# EasyEDA Pro project Omnimo_nRF52840_1v2.eprj, schematic Omnimo nRF52840_v1_2

## Sheets
1 Omnimo_nrf52840_v1_2_sheet_1: Board Name: Omnimo nRF52840_v1_2; Create Date: 2025-02-22; Page Name: Omnimo_nrf52840_v1_2_sheet_1; Project Name: Omnimo_nRF52840_1v2; Schematic Name: Omnimo nRF52840_v1_2; Update Date: 2025-11-02; Company: eAFAQ; Drawn: I. MEZZAH; Page Size: A4; Version: V1.2
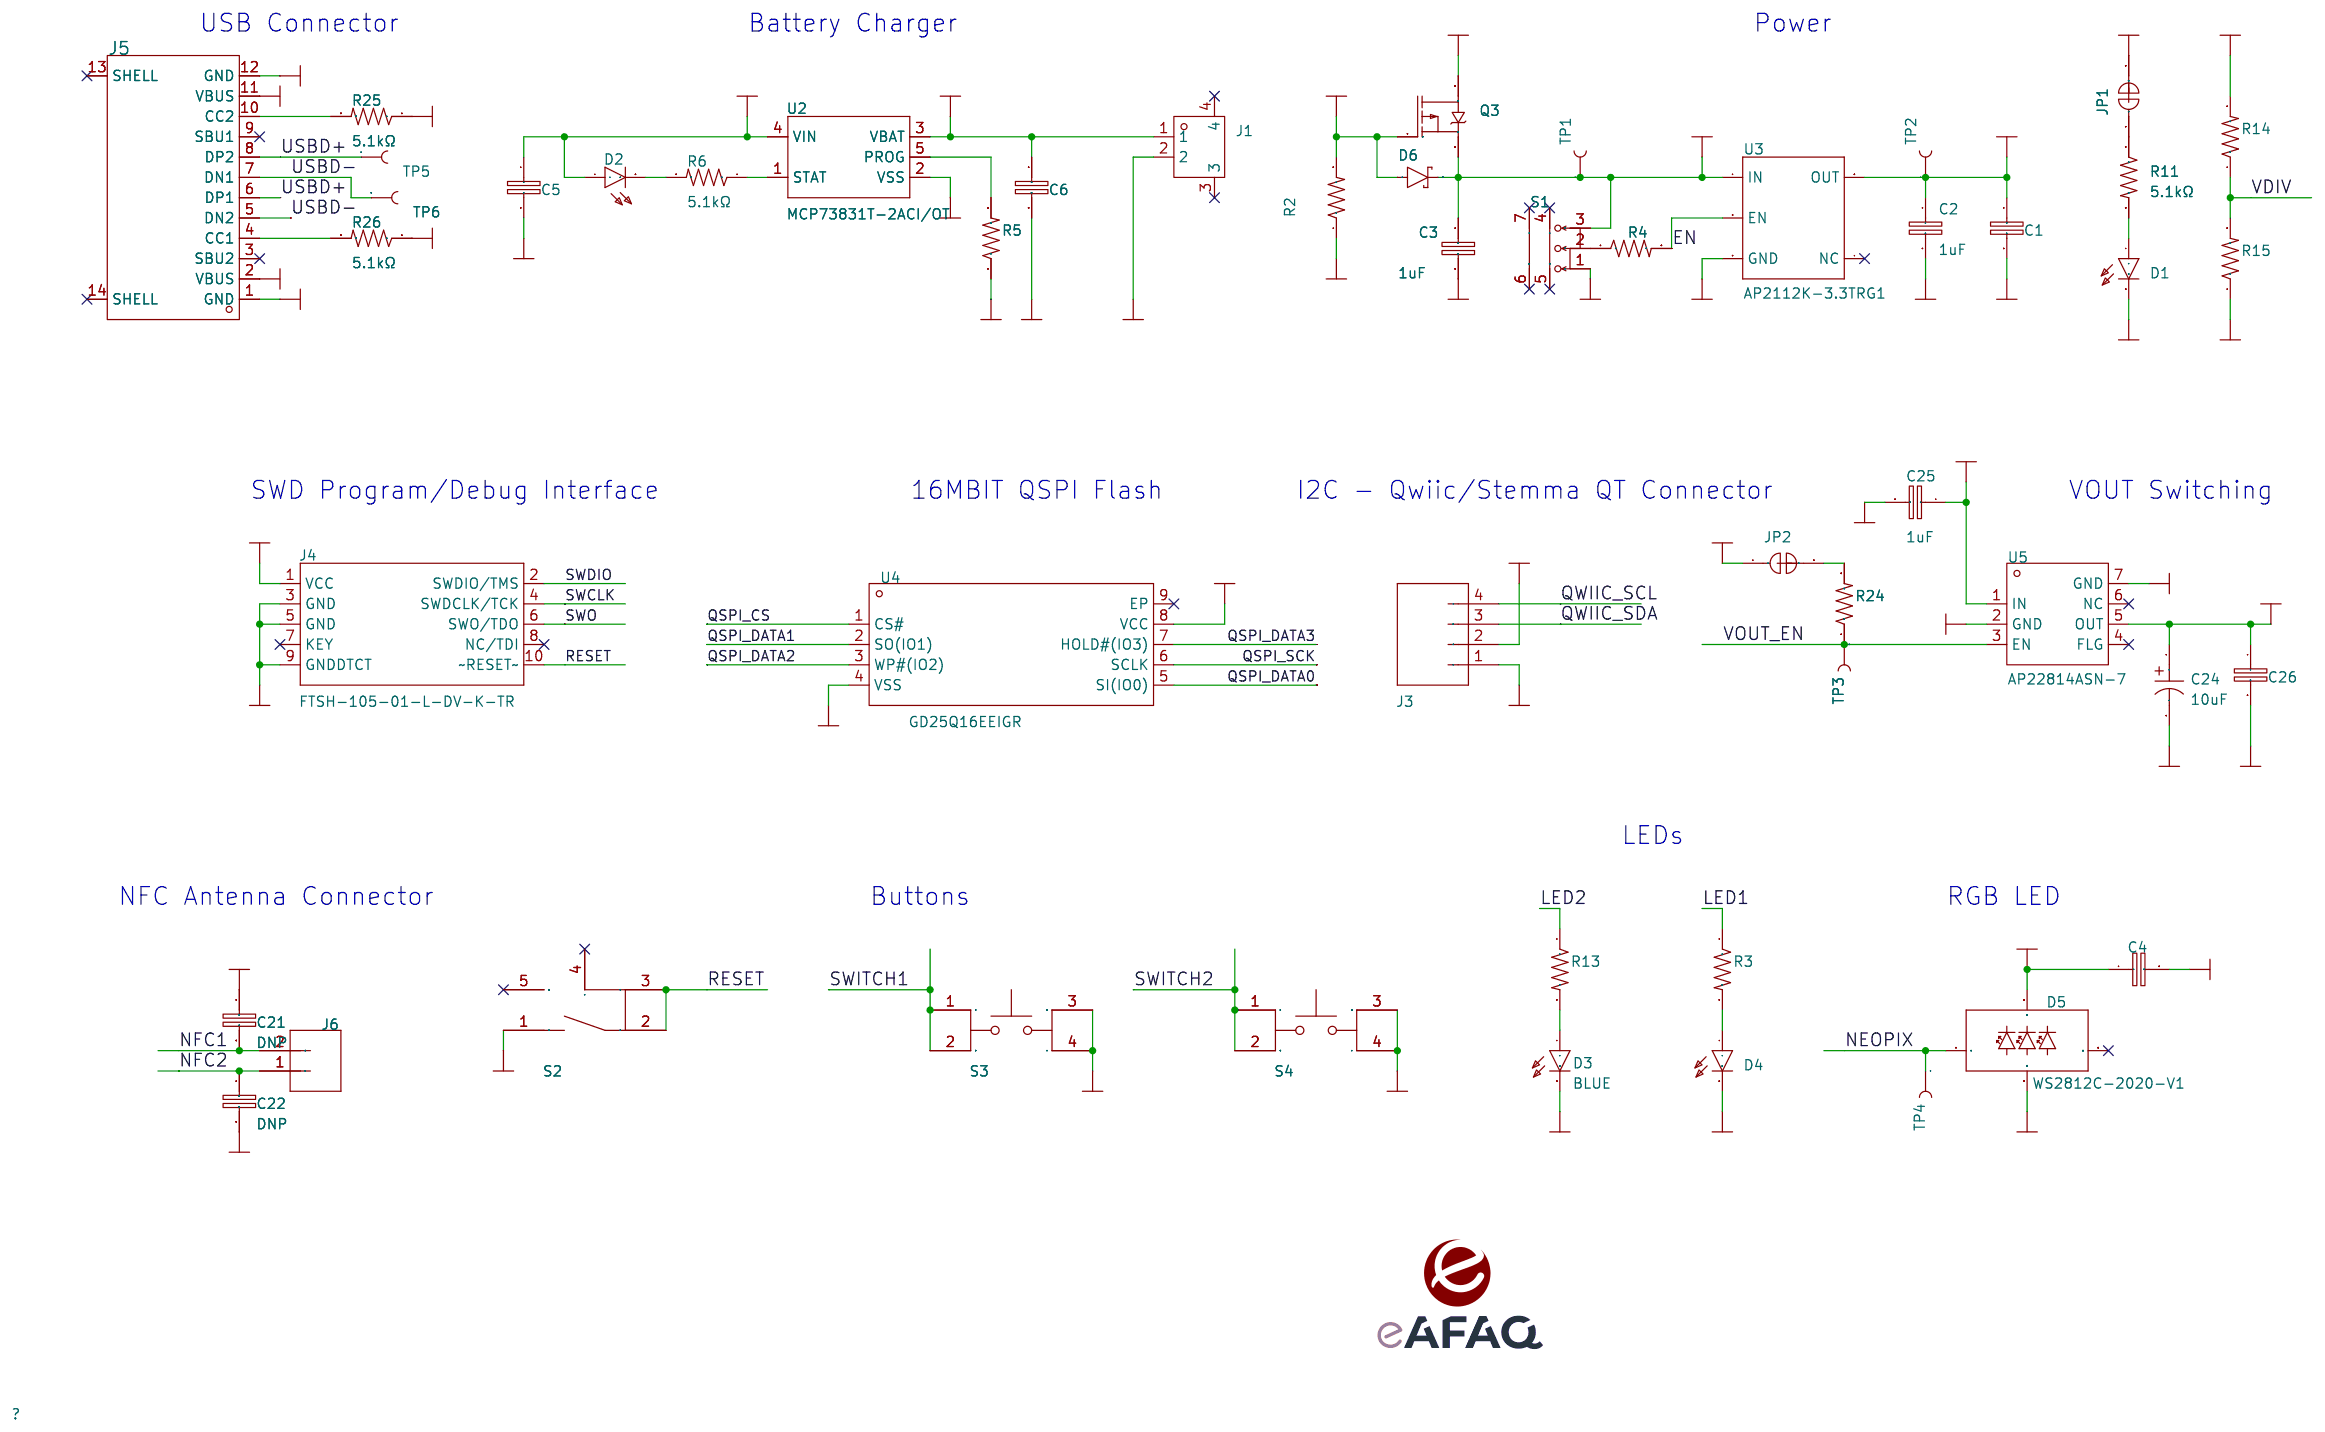
[diagram p0: Omnimo_nrf52840_v1_2_sheet_1]
2 Omnimo_nrf52840_v1_2_sheet_2: Page Name: Omnimo_nrf52840_v1_2_sheet_2; Update Date: 2025-10-13
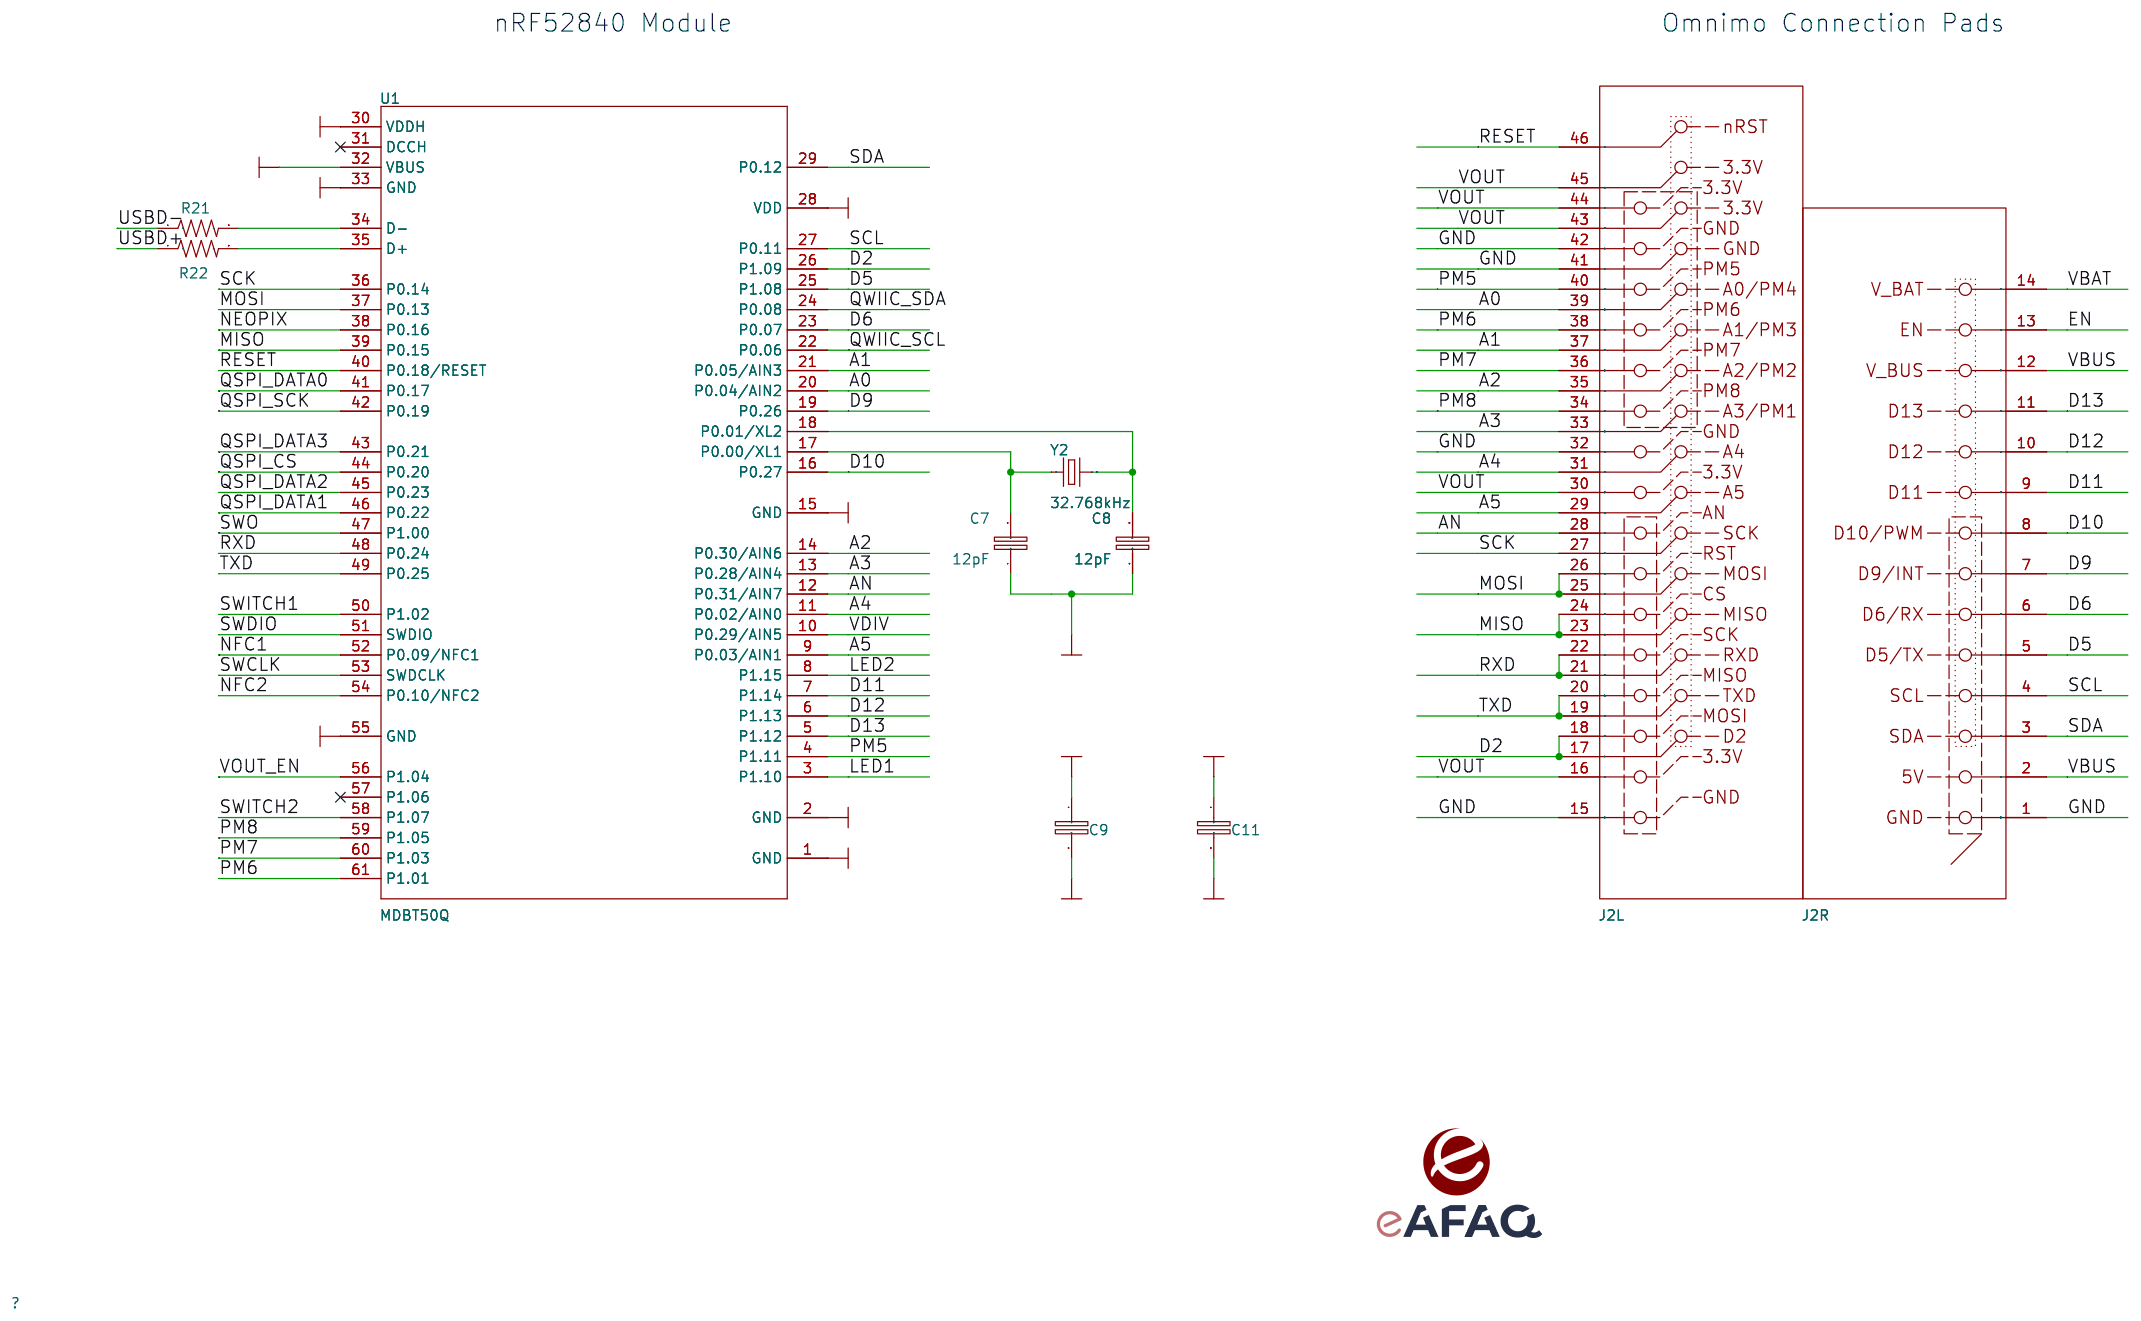
[diagram p1: Omnimo_nrf52840_v1_2_sheet_2]

## Parts
sheet Omnimo_nrf52840_v1_2_sheet_1
C1  10uF  [0603_Nom]
C2  1uF  [0402_NOM]
C3  1uF  [0402_NOM]
C4  100nF  [0402_NOM]
C5  4.7uF  [0402_NOM]
C6  4.7uF  [0402_NOM]
C21  DNP  [0603_Nom]  (no BOM)
C22  DNP  [0603_Nom]  (no BOM)
C24  10uF  [CAP-SMD_L1.6-W0.8]
C25  1uF  [0402_NOM]
C26  100nF  [0402_NOM]
D1  RED  [LED-0603_2]
D2  ORANGE  [LED-0603_2]
D3  BLUE  [LED-0603_2]
D4  RED  [LED-0603_2]
D5  WS2812C-2020-V1  [WS2812-2020]
D6  BAT60B  [SOD-323]
J1  S2B-PH-SM4-TB(LF)(SN)  [CONN-SMD_P2.00_S2B-PH-SM4-TB-LF-SN]
J3  SM04B-SRSS-TB(LF)(SN)  [1X04_1MM_RA]
J4  FTSH-105-01-L-DV-K-TR  [SAMTEC_FTSH-105-XX-X-DV]
J5  TYPE-C 16PIN 2MD(073)  [USB-C-SMD_TYPE-C-6PIN-2MD-073]
J6  CONN_021X02  [1X02_NFC]  (no BOM)
JP1  JUMPER-SMT_2_NC_TRACE_SILK  [SMT-JUMPER_2_NC_TRACE_SILK_2]  (no BOM)
JP2  JUMPER-SMT_2_NC_TRACE_SILK  [SMT-JUMPER_2_NC_TRACE_SILK_2]  (no BOM)
Q3  DMG2305UXQ-7  [SOT23-3]
R2  100kΩ  [0402_NOM]
R3  2.2kΩ  [0402_NOM]
R4  100kΩ  [0402_NOM]
R5  2kΩ  [0402_NOM]
R6  5.1kΩ  [0402_NOM]
R11  5.1kΩ  [0402_NOM]
R13  2.2kΩ  [0402_NOM]
R14  100kΩ  [0402_NOM]
R15  100kΩ  [0402_NOM]
R24  100kΩ  [0402_NOM]
R25  5.1kΩ  [0402_NOM]
R26  5.1kΩ  [0402_NOM]
S1  TA-3514-A1-B  [SW-SMD_TA-3514-A1-B]
S2  R-667270  [SW-SMD_MITSUMI_R-667270]
S3  PTS815SJG250SMTRLFS  [SW_PTS810_SJM_250_SMTR_LFS]
S4  PTS815SJG250SMTRLFS  [SW_PTS810_SJM_250_SMTR_LFS]
TP1  TEST-POINT3X5  [TEST_POINT_1mm]  (no BOM)
TP2  TEST-POINT3X5  [TEST_POINT_1mm]  (no BOM)
TP3  TEST-POINT3X5  [TEST_POINT_1mm]  (no BOM)
TP4  TEST-POINT3X5  [TEST_POINT_1mm]  (no BOM)
TP5  TEST-POINT3X5  [TEST_POINT_1mm]  (no BOM)
TP6  TEST-POINT3X5  [TEST_POINT_1mm]  (no BOM)
U2  MCP73831T-2ACI/OT  [SOT23-5]
U3  AP2112K-3.3TRG1  [SOT23-5]
U4  GD25Q16EEIGR  [USON-8_L3.0-W2.0-P0.50-BL-EP_GD25QXX]
U5  AP22814ASN-7  [U-DFN2020-6_L2.0-W2.0-P0.65-BL-EP]
sheet Omnimo_nrf52840_v1_2_sheet_2
C7  12pF  [0402_NOM]
C8  12pF  [0402_NOM]
C9  10uF  [0603_Nom]
C11  100nF  [0402_NOM]
J2L  omnimo_Header_left  [Omnimo_HDR_Left_nRF52_2 - without silk screen]  (no BOM)
J2R  omnimo_Header_right  [Omnimo_HDR_Right_nRF52_2 - without silk screen]  (no BOM)
R21  27Ω  [0402_NOM]
R22  27Ω  [0402_NOM]
U1  MDBT50Q  [MDBT50Q-1MV2]
Y2  32.768kHz  [CRYSTAL-SMD-3.2X1.5MM]

## Library data of the parts
C1 C9 = CC0603KRX5R5BB106: Capacitance: Tolerance:±10% Tolerance:±10% Voltage Rated: Temperature Coefficient:; LCSC Part Name: 10uF ±10% 6.3V; Supplier Part: C109455; Manufacturer: YAGEO(国巨); Supplier Footprint: 0603; JLCPCB Part Class: Extended Part; Datasheet: https://atta.szlcsc.com/upload/public/pdf/source/20180326/C109455_625EE17E247DD6FE38AEE20903B28532.pdf; Supplier: LCSC; Tolerance: ±10%; Design Item ID: 10UF-0603-6.3V-20%; Library Name: eAFAQ_omnimo_nRF52840_SchLib
C2 C3 C25 = CL05A105KO5NNNC: Capacitance: Tolerance:±10% Tolerance:±10% Voltage Rated: Temperature Coefficient:; LCSC Part Name: 1uF ±10% 16V; Supplier Part: C29266; Manufacturer: SAMSUNG(三星); Supplier Footprint: 0402; JLCPCB Part Class: Extended Part; Datasheet: https://atta.szlcsc.com/upload/public/pdf/source/20160218/1457707763339.pdf; Supplier: LCSC; Tolerance: ±10%; Design Item ID: 1.0UF-0402T-16V-10%; Library Name: eAFAQ_omnimo_nRF52840_SchLib; Manufacturer Part Number: C0402C105K4PAC7867; Origin Footprint 2: 0402-TIGHT
C4 = CC0402KRX5R6BB104: Capacitance: Tolerance:±10% Tolerance:±10% Voltage Rated: Temperature Coefficient:; LCSC Part Name: 100nF ±10% 10V; Supplier Part: C129131; Manufacturer: YAGEO(国巨); Supplier Footprint: 0402; JLCPCB Part Class: Extended Part; Datasheet: https://atta.szlcsc.com/upload/public/pdf/source/20190902/C129131_1F7380F90717E359943DE220DC579DE6.pdf; Supplier: LCSC; Tolerance: ±10%; PROD_ID: CAP-00810; Design Item ID: 0.1UF-0603-25V-(+80/-20%); Library Name: eAFAQ_omnimo_nRF52840_SchLib; Manufacturer Part Number: C0402C104K8PACTU
C5 C6 = CC0402MRX5R5BB475: Capacitance: Tolerance:±20% Tolerance:±20% Voltage Rated: Temperature Coefficient:; LCSC Part Name: 4.7uF ±20% 6.3V; Supplier Part: C106859; Manufacturer: YAGEO(国巨); Supplier Footprint: 0402; JLCPCB Part Class: Extended Part; Datasheet: https://atta.szlcsc.com/upload/public/pdf/source/20180326/C106859_A823F8B92C4BCB9106BEAF7D8A2C4613.pdf; Supplier: LCSC; Tolerance: ±20%; Design Item ID: 4.7UF-0603-6.3V-(10%); Library Name: eAFAQ_omnimo_nRF52840_SchLib
C21 C22 = DNP: 10.0µF ceramic capacitors    A capacitor is a passive two-terminal electrical component used to store electrical energy temporarily in an electric field.; PROD_ID: CAP-11015; Design Item ID: 10UF-0603-6.3V-20%; Library Name: eAFAQ_omnimo_nRF52840_SchLib
C24 = TMCJ0J106MTRF: 10 µF Molded Tantalum Capacitors 6.3 V 0603 (1608 Metric) 10Ohm @ 100kHz; LCSC Part Name: 10uF ±20% 6.3V; Supplier Part: C1953982; Manufacturer: VISHAY(威世); Supplier Footprint: 0603; JLCPCB Part Class: Extended Part; Datasheet: https://item.szlcsc.com/datasheet/TMCJ0J106MTRF/2045516.html; Supplier: LCSC; Tolerance: ±20%; Voltage Rating: 6.3V; Equivalent Series Resistance(ESR): 10Ω@100kHz; Operating Temperature: -55℃~+125℃
C11 C26 = CC0402KRX5R6BB104: Capacitance: Tolerance:±10% Tolerance:±10% Voltage Rated: Temperature Coefficient:; LCSC Part Name: 100nF ±10% 10V; Supplier Part: C129131; Manufacturer: YAGEO(国巨); Supplier Footprint: 0402; JLCPCB Part Class: Extended Part; Datasheet: https://atta.szlcsc.com/upload/public/pdf/source/20190902/C129131_1F7380F90717E359943DE220DC579DE6.pdf; Supplier: LCSC; Tolerance: ±10%; Design Item ID: 0.1UF-0603-25V-(+80/-20%); Library Name: eAFAQ_omnimo_nRF52840_SchLib; PROD_ID: CAP-00810; Manufacturer Part Number: C0402C104K8PACTU
D1 D4 = XL-1608SURC-06: Emitted Color:Red Power Dissipation:55mW Forward Current:25mA Dominant Wavelength:617nm~621nm Dominant Wavelength:617nm~621nm Peak Wavelength:623nm Lens Color:无色透明透镜 Color Temperature:- Color Temperature:- Viewing Angle:120° Mounting Sytle:Positive post O; Supplier Part: C965799; Manufacturer: XINGLIGHT(成兴光); Supplier Footprint: 0603; JLCPCB Part Class: Extended Part; Datasheet: https://atta.szlcsc.com/upload/public/pdf/source/20221102/D860AFDD1CDB02C5A8064103A32707E2.pdf; Supplier: LCSC; Emitted Color: Red; Power Dissipation: 55mW; Forward Current: 25mA; Dominant Wavelength: 617nm~621nm; Peak Wavelength: 623nm; Lens Color: 无色透明透镜; Viewing Angle: 120°; Mounting Sytle: Positive post; Operating Temperature: -30℃~+85℃; Forward Voltage (VF): 2.8V; Luminous Intensity: 260mcd; Design Item ID: LED-WHITE-0603; Library Name: eAFAQ_omnimo_nRF52840_SchLib; Manufacturer Part Number: NCD1608W1; Origin Footprint 2: LED-0603
D2 = XL-1608UOC-06: Emitted Color:Orange Power Dissipation:55mW Forward Current:25mA Dominant Wavelength:601nm~603nm Dominant Wavelength:601nm~603nm Peak Wavelength:605nm Lens Color:无色透明透镜 Color Temperature:- Color Temperature:- Viewing Angle:120° Mounting Sytle:Positive pos; Supplier Part: C965800; Manufacturer: XINGLIGHT(成兴光); Supplier Footprint: 0603; JLCPCB Part Class: Extended Part; Datasheet: https://atta.szlcsc.com/upload/public/pdf/source/20221102/AE009D8ACFA5525E08B22F015CB50531.pdf; Supplier: LCSC; Emitted Color: Orange; Power Dissipation: 55mW; Forward Current: 25mA; Dominant Wavelength: 601nm~603nm; Peak Wavelength: 605nm; Lens Color: 无色透明透镜; Viewing Angle: 120°; Mounting Sytle: Positive post; Operating Temperature: -30℃~+85℃; Design Item ID: LED-ORANGE0603; Library Name: eAFAQ_omnimo_nRF52840_SchLib; Manufacturer Part Number: 5988050107F; Origin Footprint 2: LED-0603
D3 = XL-1608UBC-04: Emitted Color:Blue Power Dissipation:80mW Forward Current:25mA Dominant Wavelength:460nm~469nm Dominant Wavelength:460nm~469nm Peak Wavelength:475nm Lens Color:无色透明透镜 Color Temperature:- Color Temperature:- Viewing Angle:120° Mounting Sytle:Positive post; Supplier Part: C965807; Manufacturer: XINGLIGHT(成兴光); Supplier Footprint: 0603; JLCPCB Part Class: Extended Part; Datasheet: https://atta.szlcsc.com/upload/public/pdf/source/20240218/F76B043D1CDACE9DB8357580572EF0D5.pdf; Supplier: LCSC; Emitted Color: Blue; Power Dissipation: 80mW; Forward Current: 25mA; Dominant Wavelength: 460nm~469nm; Peak Wavelength: 475nm; Lens Color: 无色透明透镜; Viewing Angle: 120°; Mounting Sytle: Positive post; Operating Temperature: -30℃~+85℃; Forward Voltage (VF): 3.3V; Luminous Intensity: 100mcd; Design Item ID: LED-BLUE0603; Library Name: eAFAQ_omnimo_nRF52840_SchLib; Manufacturer Part Number: 5988091107F; Origin Footprint 2: LED-0603
D5 = WS2812C-2020-V1: Addressable Lighting Neopixel LED Discrete Red, Green, Blue (RGB) 2.00mm L x 2.00mm W; LCSC Part Name: RGB三色; Supplier Part: C2976072; Manufacturer: worldsemi; Supplier Footprint: SMD,2x2mm; JLCPCB Part Class: Extended Part; Datasheet: https://atta.szlcsc.com/upload/public/pdf/source/20220222/52A01000447F5320C9A8C3F34CEFDB81.pdf; Supplier: LCSC; Library Name: eAFAQ_omnimo_nRF52840_SchLib
D6 = BAT60B_C7502695: Diode Configuration:Single Forward Voltage (Vf@If):600mV@1A Reverse Voltage (Vr):10V Rectified Current:3A Reverse Leakage Current (Ir):25uA; LCSC Part Name: 电压:10V 电流:3A; Supplier Part: C7502695; Manufacturer: 宏迦橙; JLCPCB Part Class: Extended Part; Datasheet: https://atta.szlcsc.com/upload/public/pdf/source/20230828/25AE167151E881636AF68D9C9ECB5F9C.pdf; Supplier: LCSC; Diode Configuration: Single; Forward Voltage (Vf@If): 600mV@1A; Reverse Voltage (Vr): 10V; Rectified Current: 3A; Reverse Leakage Current (Ir): 25uA; Design Item ID: DIODE-SCHOTTKY-BAT60A; Library Name: eAFAQ_omnimo_nRF52840_SchLib; Manufacturer Part Number: BAT60AE6327HTSA1
J1 = S2B-PH-SM4-TB(LF)(SN): Pins Structure:1x2P Pitch:2mm Mounting Style:卧贴 Reference Series:PH Number of Pins:2P Number of Rows:1 Number of PINs Per Row:2 Row Spacing:- Current Rating (Max):2A Contact Material:Copper Alloy Contact Plating:Tin Operating Temperature Range:-25℃~+85℃ O; LCSC Part Name: 1x2P 间距:2mm 卧贴 系列:PH; Supplier Part: C295747; Manufacturer: JST; Supplier Footprint: SMD,P=2mm,卧贴; JLCPCB Part Class: Extended Part; Datasheet: https://atta.szlcsc.com/upload/public/pdf/source/20210203/C295747_344B2E64535E381E727D98C302AB61C7.pdf; Supplier: LCSC; Pins Structure: 1x2P; Pitch: 2mm; Mounting Style: 卧贴; Reference Series: PH; Number of Pins: 2P; Number of Rows: 1; Number of PINs Per Row: 2; Current Rating (Max): 2A; Contact Material: Copper Alloy; Contact Plating: Tin; Operating Temperature Range: -25℃~+85℃; Rated Voltage (Max): 100V; Plastic Material: PA; Flame Retardant Rating: UL94V-0; Supplementary Features: 辅助焊脚; Colour: 米色; Z-Height of the Board: 5.5mm; X-Length of Bottom Edge on Board (Spacing Line): 7.9mm; Y-Width of Bottom Edge on Board: 8.6mm; Design Item ID: JST_2MM_MALESMD; Library Name: eAFAQ_omnimo_nRF52840_SchLib; PROD_ID: CONN-11443; SF_ID: PRT-08612; Manufacturer Part Number: S2B-PH-SM4-K-TB (LF)(SN); Manufacturer Part Number2: 1769
J3 = SM04B-SRSS-TB(LF)(SN): Pins Structure:1x4P Pitch:1mm Mounting Style:卧贴 Reference Series:SH Number of Pins:4P Number of Rows:1 Number of PINs Per Row:4 Row Spacing:- Current Rating (Max):1A Contact Material:Copper Alloy Contact Plating:Tin Operating Temperature Range:-25℃~+85℃ O; LCSC Part Name: 1x4P 间距:1mm 卧贴 系列:SH; Supplier Part: C160404; Manufacturer: JST; Supplier Footprint: SMD,P=1mm,卧贴; JLCPCB Part Class: Extended Part; Datasheet: https://atta.szlcsc.com/upload/public/pdf/source/20181010/C265335_7D2AD766CA0E20E745663C87507A223E.pdf; Supplier: LCSC; Pins Structure: 1x4P; Pitch: 1mm; Mounting Style: 卧贴; Reference Series: SH; Number of Pins: 4P; Number of Rows: 1; Number of PINs Per Row: 4; Current Rating (Max): 1A; Contact Material: Copper Alloy; Contact Plating: Tin; Operating Temperature Range: -25℃~+85℃; Rated Voltage (Max): 50V; Plastic Material: PA; Flame Retardant Rating: UL94V-0; Supplementary Features: 辅助焊脚; Colour: White; Z-Height of the Board: 2.9mm; X-Length of Bottom Edge on Board (Spacing Line): 6mm; Y-Width of Bottom Edge on Board: 4.32mm; Design Item ID: JST-4-CONNECTOR-1MM; Library Name: eAFAQ_omnimo_nRF52840_SchLib; Manufacturer Part Number2: PRT-14417
J4 = FTSH-105-01-L-DV-K-TR: Number of Pins:10P Pitch:1.27mm Gender:公 Mounting Style:Brick nogging Number of Rows:2 Current Rating (Max):3.4A Operating Temperature Range:-55℃~+125℃ Operating Temperature Range:-55℃~+125℃; LCSC Part Name: 间距:1.27mm PIN:10P 公 立贴; Supplier Part: C448647; Manufacturer: SAMTEC; Supplier Footprint: SMD,P=1.27mm; JLCPCB Part Class: Extended Part; Datasheet: https://atta.szlcsc.com/upload/public/pdf/source/20191118/C448647_205392910665CE4219C540D554585953.pdf; Supplier: LCSC; Number of Pins: 10P; Pitch: 1.27mm; Gender: 公; Mounting Style: Brick nogging; Number of Rows: 2; Current Rating (Max): 3.4A; Operating Temperature Range: -55℃~+125℃; Design Item ID: CORTEX_DEBUG_PTH; Library Name: eAFAQ_omnimo_nRF52840_SchLib; Origin Footprint 2: 2X5-PTH-1.27MM
J5 = TYPE-C 16PIN 2MD(073): Connector Type:Type-C Standard:- Gender:Female Number of Ports:1 Number of Contacts:16P Mounting Style:卧贴 Current Rating - Power (Max):5A Operating Temperature Range:-25℃~+85℃ Operating Temperature Range:-25℃~+85℃; LCSC Part Name: Type-C 母 卧贴; Supplier Part: C2765186; Manufacturer: SHOU HAN(首韩); Supplier Footprint: SMD; JLCPCB Part Class: Extended Part; Datasheet: https://atta.szlcsc.com/upload/public/pdf/source/20211123/39B17C16241EAC15C5E277BDA434118E.pdf; Supplier: LCSC; Connector Type: Type-C; Gender: Female; Number of Ports: 1; Number of Contacts: 16P; Mounting Style: 卧贴; Current Rating - Power (Max): 5A; Operating Temperature Range: -25℃~+85℃
J6 = CONN_021X02: Multi connection point. Often used as Generic Header-pin footprint for 0.1 inch spaced/style header connections    On any of the 0.1 inch spaced packages, you can populate with these:  Break Away Headers - Straight (PRT-00116)   Break Away Male Headers - Right Angle (PRT-00553)   Female Headers (PRT-00115)   Break Away Headers - Machine Pin (PRT-00117)   Break Away Female Headers - Swiss Machine Pin (PRT-00743)        For SCREWTERMINALS and SPRING TERMINALS visit here:  Screw Terimnals on SparkFun.com (5mm/3.5mm/2.54mm spacing)       This device is also useful as a general connection point to wire up your design to another part of your project. Our various solder wires solder well into these plated through hole pads.  Hook-Up Wire - Assortment (Stranded, 22 AWG) (PRT-11375)   Hook-Up Wire - Assortment (Solid Core, 22 AWG) (PRT-11367)   View the entire wire category on our website here          Special notes: Molex polarized connector foot print use with: PRT-08233 with associated crimp pins and housings.  2.54_SCREWTERM for use with  PRT-10571.  3.5mm Screw Terminal footprints for  PRT-08084  5mm Screw Terminal footprints for use with PRT-08432; Origin Footprint 2: 1X02_NO_SILK; Design Item ID: CONN_021X02_NO_SILK; Library Name: eAFAQ_omnimo_nRF52840_SchLib
JP1 JP2 = JUMPER-SMT_2_NC_TRACE_SILK: Normally closed trace jumper    This jumper has a trace between two pads so it&apos;s normally closed (NC). Use a razor knife to open the connection. For best results follow the IPC guidelines for cutting traces: Cutout at least 0.063 mm (0.005 in).  Remove all loose material to clean up the cut area.  Seal the cut with an approved epoxy.       Reapply solder to reclose the connection.; Origin Footprint 2: SMT-JUMPER_2_NC_TRACE_SILK; Library Name: eAFAQ_omnimo_nRF52840_SchLib
Q3 = DMG2305UXQ-7: Type:1个PChannel Drain Source Voltage (Vdss): Continuous Drain Current (Id): Power Dissipation (Pd): Drain Source On Resistance (RDS(on)@Vgs,Id):52mΩ@4.5V,4.2A Gate Threshold Voltage (Vgs(th)@Id):900mV@250uA Total Gate Charge (Qg@Vgs):10.2nC@4.5V Input Cap; LCSC Part Name: 1个P沟道 耐压:20V 电流:4.2A; Supplier Part: C508197; Manufacturer: DIODES(美台); Supplier Footprint: SOT-23; JLCPCB Part Class: Extended Part; Datasheet: https://atta.szlcsc.com/upload/public/pdf/source/20200407/C508197_17911125F7EBC283E432AC4360B4CFE9.pdf; Supplier: LCSC; Type: 1个PChannel; Drain Source On Resistance (RDS(on)@Vgs,Id): 52mΩ@4.5V,4.2A; Gate Threshold Voltage (Vgs(th)@Id): 900mV@250uA; Total Gate Charge (Qg@Vgs): 10.2nC@4.5V; Input Capacitance (Ciss@Vds): 808pF@15V; Operating Temperature: -55℃~+150℃@(Tj); Design Item ID: MOSFET_PCH-DMG2305UX-7; Library Name: eAFAQ_omnimo_nRF52840_SchLib
R2 R24 = RC0402FR-07100KL: Type:Thick Film Resistors Resistance: Tolerance:±1% Tolerance:±1% Power(Watts): Overload Voltage (Max): Temperature Coefficient:±100ppm/℃ Temperature Coefficient:±100ppm/℃ Operating Temperature Range:-55℃~+155℃ Operating Temperature Range:-55℃~+155℃; LCSC Part Name: 厚膜电阻 100kΩ ±1% 62.5mW; Supplier Part: C60491; Manufacturer: YAGEO(国巨); Supplier Footprint: 0402; JLCPCB Part Class: Extended Part; Datasheet: https://atta.szlcsc.com/upload/public/pdf/source/20180927/C295883_E8D83085EA81BD7DE0B2B681138C15EE.pdf; Supplier: LCSC; Type: Thick Film Resistors; Tolerance: ±1%; Temperature Coefficient: ±100ppm/℃; Operating Temperature Range: -55℃~+155℃; Design Item ID: 100KOHM-0603-1/10W-1%; Library Name: eAFAQ_omnimo_nRF52840_SchLib; Origin Footprint 2: 0603_Nom
R3 R13 = RC0402FR-072K2L: Type:Thick Film Resistors Resistance: Tolerance:±1% Tolerance:±1% Power(Watts): Overload Voltage (Max): Temperature Coefficient:±100ppm/℃ Temperature Coefficient:±100ppm/℃ Operating Temperature Range:-55℃~+155℃ Operating Temperature Range:-55℃~+155℃; LCSC Part Name: 厚膜电阻 2.2kΩ ±1% 62.5mW; Supplier Part: C114762; Manufacturer: YAGEO(国巨); Supplier Footprint: 0402; JLCPCB Part Class: Extended Part; Datasheet: https://atta.szlcsc.com/upload/public/pdf/source/20180821/C275644_0D56F95EFF785E7D9A1FEF436B37DA78.pdf; Supplier: LCSC; Type: Thick Film Resistors; Tolerance: ±1%; Temperature Coefficient: ±100ppm/℃; Operating Temperature Range: -55℃~+155℃; Design Item ID: 1KOHM-0603-1/10W-1%; Library Name: eAFAQ_omnimo_nRF52840_SchLib; Manufacturer Part Number: RC0402FR-071KL
R4 = RC0402FR-07100KL: Type:Thick Film Resistors Resistance: Tolerance:±1% Tolerance:±1% Power(Watts): Overload Voltage (Max): Temperature Coefficient:±100ppm/℃ Temperature Coefficient:±100ppm/℃ Operating Temperature Range:-55℃~+155℃ Operating Temperature Range:-55℃~+155℃; LCSC Part Name: 厚膜电阻 100kΩ ±1% 62.5mW; Supplier Part: C60491; Manufacturer: YAGEO(国巨); Supplier Footprint: 0402; JLCPCB Part Class: Extended Part; Datasheet: https://atta.szlcsc.com/upload/public/pdf/source/20180927/C295883_E8D83085EA81BD7DE0B2B681138C15EE.pdf; Supplier: LCSC; Type: Thick Film Resistors; Tolerance: ±1%; Temperature Coefficient: ±100ppm/℃; Operating Temperature Range: -55℃~+155℃; Design Item ID: 1KOHM-0603-1/10W-1%; Library Name: eAFAQ_omnimo_nRF52840_SchLib; Manufacturer Part Number: RC0402FR-0710KL
R5 = RC0402JR-072KL: Type:Thick Film Resistors Resistance: Tolerance:±5% Tolerance:±5% Power(Watts): Overload Voltage (Max): Temperature Coefficient:±100ppm/℃ Temperature Coefficient:±100ppm/℃ Operating Temperature Range:-55℃~+155℃ Operating Temperature Range:-55℃~+155℃; LCSC Part Name: 厚膜电阻 2kΩ ±5% 62.5mW; Supplier Part: C137887; Manufacturer: YAGEO(国巨); Supplier Footprint: 0402; JLCPCB Part Class: Extended Part; Datasheet: https://atta.szlcsc.com/upload/public/pdf/source/20181009/C309620_DA5935B6E1D48212CB7A533FE518B3C2.pdf; Supplier: LCSC; Type: Thick Film Resistors; Tolerance: ±5%; Temperature Coefficient: ±100ppm/℃; Operating Temperature Range: -55℃~+155℃; Design Item ID: 2.0KOHM-0603-1/10W-5%; Library Name: eAFAQ_omnimo_nRF52840_SchLib
R6 R11 R25 R26 = RC0402FR-075K1L: Type:Thick Film Resistors Resistance: Tolerance:±1% Tolerance:±1% Power(Watts): Overload Voltage (Max): Temperature Coefficient:±100ppm/℃ Temperature Coefficient:±100ppm/℃ Operating Temperature Range:-55℃~+155℃ Operating Temperature Range:-55℃~+155℃; LCSC Part Name: 厚膜电阻 5.1kΩ ±1% 62.5mW; Supplier Part: C105872; Manufacturer: YAGEO(国巨); Supplier Footprint: 0402; JLCPCB Part Class: Extended Part; Datasheet: https://atta.szlcsc.com/upload/public/pdf/source/20180821/C275644_0D56F95EFF785E7D9A1FEF436B37DA78.pdf; Supplier: LCSC; Type: Thick Film Resistors; Tolerance: ±1%; Temperature Coefficient: ±100ppm/℃; Operating Temperature Range: -55℃~+155℃; Design Item ID: 5.1KOHM-0402T-1/16W-1%; Library Name: eAFAQ_omnimo_nRF52840_SchLib; Origin Footprint 2: 0402-TIGHT
R14 R15 = RC0402DR-07100KL: Type:Thick Film Resistors Resistance: Tolerance:±0.5% Tolerance:±0.5% Power(Watts): Overload Voltage (Max): Temperature Coefficient:±100ppm/℃ Temperature Coefficient:±100ppm/℃ Operating Temperature Range:-55℃~+155℃ Operating Temperature Range:-55℃~+155℃; LCSC Part Name: 厚膜电阻 100kΩ ±0.5% 62.5mW; Supplier Part: C138080; Manufacturer: YAGEO(国巨); Supplier Footprint: 0402; JLCPCB Part Class: Extended Part; Datasheet: https://atta.szlcsc.com/upload/public/pdf/source/20181009/C309620_DA5935B6E1D48212CB7A533FE518B3C2.pdf; Supplier: LCSC; Type: Thick Film Resistors; Tolerance: ±0.5%; Temperature Coefficient: ±100ppm/℃; Operating Temperature Range: -55℃~+155℃; Design Item ID: 100KOHM-0603-1/10W-1%; Library Name: eAFAQ_omnimo_nRF52840_SchLib; Manufacturer Part Number: RC0402FR-07100KL; Origin Footprint 2: 0603_Nom
S1 = TA-3514-A1-B: LCSC Part Name: 滑动开关5.0*2.7*1.5mm贴片侧拨迷你七脚二档; Supplier Part: C513999; Manufacturer: Yuandi(元迪); Supplier Footprint: SMD,2.7x5mm; JLCPCB Part Class: Extended Part; Datasheet: https://atta.szlcsc.com/upload/public/pdf/source/20200415/C513999_8CC5CAE727CD40AE58851590407BDDFB.pdf; Supplier: LCSC
S2 = R-667270: Circuit:SPST Actuator Style:Rectangle button Operating Force:204gf Mounting Style:Brick nogging Contact Current:0.05A Voltage Rating (DC):12V IP Rating:- Pin Style:SMDSplicing Mechanical Life:100000次 Operating Temperature:- Operating Temperature:-; Supplier Part: C4364381; Manufacturer: MITSUMI(美上美); JLCPCB Part Class: Extended Part; Supplier: LCSC; Circuit: SPST; Actuator Style: Rectangle button; Operating Force: 204gf; Mounting Style: Brick nogging; Contact Current: 0.05A; Voltage Rating (DC): 12V; Pin Style: SMDSplicing; Mechanical Life: 100000次; Design Item ID: Tact Switch - PTS815 Series_1; Library Name: eAFAQ_omnimo_nRF52840_SchLib; Base Product Number: SOU-24
S3 S4 = PTS815SJG250SMTRLFS: Circuit:SPST Actuator Style:Oval button Operating Force:400gf Mounting Style:Brick nogging Switch Length:4.2mm Switch Width:3.2mm Switch Height:2.5mm Contact Current:50mA Voltage Rating (DC):12V With Lamp:- IP Rating:IP40 Pin Style:J pin Mechanical Life:-; LCSC Part Name: 4.2*3.2*2.5mm 立贴 轻触开关; Supplier Part: C411883; Manufacturer: C&K; Supplier Footprint: SMD; JLCPCB Part Class: Extended Part; Datasheet: https://atta.szlcsc.com/upload/public/pdf/source/20190916/C411883_4F77F16E1D8E48DC707D8949CEE7CF80.pdf; Supplier: LCSC; Circuit: SPST; Actuator Style: Oval button; Operating Force: 400gf; Mounting Style: Brick nogging; Switch Length: 4.2mm; Switch Width: 3.2mm; Switch Height: 2.5mm; Contact Current: 50mA; Voltage Rating (DC): 12V; IP Rating: IP40; Pin Style: J pin; Operating Temperature: -40℃~+90℃; Design Item ID: Tact Switch - PTS815 Series; Library Name: eAFAQ_omnimo_nRF52840_SchLib; Manufacturer Part Number: PTS815SJM250SMTRLFS; Base Product Number: PTS815
TP1-TP6 = TEST-POINT3X5: Test Point; Origin Footprint 2: PAD.03X.05; Library Name: eAFAQ_omnimo_nRF52840_SchLib
U2 = MCP73831T-2ACI/OT: Supply Voltage:6V Supply Voltage:6V Maximum Charge Current:500mA Type of Battery:锂离子/Polymer Number of Cells:1 Number of Cells:1 Operating Temperature:-40℃~+85℃ Operating Temperature:-40℃~+85℃; Supplier Part: C424093; Manufacturer: MICROCHIP(美国微芯); Supplier Footprint: SOT-23-5; JLCPCB Part Class: Extended Part; Datasheet: https://atta.szlcsc.com/upload/public/pdf/source/20190902/C424093_BB3CBFD6F009A8554318004A07DA97EE.pdf; Supplier: LCSC; Supply Voltage: 6V; Maximum Charge Current: 500mA; Type of Battery: 锂离子/Polymer; Number of Cells: 1; Operating Temperature: -40℃~+85℃; Design Item ID: MCP73831; Library Name: eAFAQ_omnimo_nRF52840_SchLib
U3 = AP2112K-3.3TRG1: Output Type: Maximum Input Voltage:6V Output Voltage:3.3V Output Voltage:3.3V MAX Output Current:600mA Power Supply Rejection Ratio (PSRR):65dB@(100Hz,1kHz) Dropout Voltage:400mV@(600mA) standby current:80uA Operating Temperature:-40℃~+85℃ Operating Tempe; LCSC Part Name: 输入6V 输出3.3V 600mA; Supplier Part: C51118; Manufacturer: DIODES(美台); Supplier Footprint: SOT-25-5; JLCPCB Part Class: Extended Part; Datasheet: https://atta.szlcsc.com/upload/public/pdf/source/20171221/C51118_15138312998391195590.pdf; Supplier: LCSC; Maximum Input Voltage: 6V; Output Voltage: 3.3V; MAX Output Current: 600mA; Power Supply Rejection Ratio (PSRR): 65dB@(100Hz,1kHz); Dropout Voltage: 400mV@(600mA); standby current: 80uA; Operating Temperature: -40℃~+85℃; Output Polarity: Positive electrode; Number of Outputs: 1; Design Item ID: V_REG_AP2112K-3.3V; Library Name: eAFAQ_omnimo_nRF52840_SchLib
U4 = GD25Q16EEIGR: Interface Type:SPI Memory Size:16Mbit Clock Frequency (fc):133MHz Supply Voltage:2.7V~3.6V Supply Voltage:2.7V~3.6V Operating Temperature:-40℃~+85℃ Operating Temperature:-40℃~+85℃; Supplier Part: C2986331; Manufacturer: GigaDevice(兆易创新); Supplier Footprint: USON-8(2x3); JLCPCB Part Class: Extended Part; Datasheet: https://atta.szlcsc.com/upload/public/pdf/source/20220401/059F5977C95025A602CED023EE3DF958.pdf; Supplier: LCSC; Interface Type: SPI; Memory Size: 16Mbit; Clock Frequency (fc): 133MHz; Supply Voltage: 2.7V~3.6V; Operating Temperature: -40℃~+85℃; Design Item ID: SPIFLASH_8PINUX; Library Name: eAFAQ_omnimo_nRF52840_SchLib; Manufacturer Part Number: GD25WQ16EEIGR
U5 = AP22804ASN-7: Power Switch/Driver 1:1 P-Channel 3A U-DFN2020-6; LCSC Part Name: 单通道功率分配负载开关; Supplier Part: C2759889; Manufacturer: DIODES(美台); Supplier Footprint: DFN2020-6-EP; JLCPCB Part Class: Extended Part; Datasheet: https://item.szlcsc.com/datasheet/AP22804ASN-7/2242391.html; Supplier: LCSC; Type: High Side Switch; Number of Channels: 1; Control Input Logic: Active Low; Maximum Continuous Current: 3A; Voltage - Supply: 2.7V~5.5V; RDS(on): 50mΩ; Operating Temperature	-: -40℃~+85℃; Features: Over Temperature Protection；Short-Circuit  Protection(SCP)；Overcurrent Protection(OCP)
C7 C8 = 12pF: 12pF, 0402, 50V, 1%; Manufacturer Part Number: 04025U120FAT2A; Manufacturer: AVX; Design Item ID: 12pF, 0402, 50V, 1%; Library Name: eAFAQ_omnimo_nRF52840_SchLib; Manufacturer Part: 04025U120FAT2A; Munufacturer Part Number 2: 0402CG120J500NT
J2L = omnimo_Header_left: Origin Footprint 2: Omnimo_HDR_Left_nRF52; Origin Footprint 3: Omnimo_HDR_Left_nRF52_2; Design Item ID: omnimo_HDR_Left; Library Name: eAFAQ_omnimo_nRF52840_SchLib
J2R = omnimo_Header_right: Origin Footprint 2: Omnimo_HDR_Right_nRF52; Origin Footprint 3: Omnimo_HDR_Right_nRF52_2; Design Item ID: omnimo_HDR_Right; Library Name: eAFAQ_omnimo_nRF52840_SchLib
R21 R22 = 27: RES 27 OHM 1% 1/10W 0402 SMD; Manufacturer: Panasonic Electronic Components; Manufacturer Part Number: ERJ-U02F27R0X; Origin Footprint 2: 0603_Nom; Design Item ID: 27OHM-0603-1/10W-1%; Library Name: eAFAQ_omnimo_nRF52840_SchLib; Manufacturer Part: ERJ-U02F27R0X
U1 = MDBT50Q: MDBT50 Bluetooth Low Energy Module based on Noridc nRF52840; Manufacturer: Raytac; Origin Footprint 2: MDBT50; Library Name: eAFAQ_omnimo_nRF52840_SchLib
Y2 = ABS07-32.768KHZ-T: Crystal Type:贴片晶振 Frequency: Normal temperature Frequency Tolerance:±20ppm Normal temperature Frequency Tolerance:±20ppm External load capacitor: Frequency Stability(Full temperature range):- Frequency Stability(Full temperature range):- Equivalent Series; LCSC Part Name: 32.768kHz ±20ppm 12.5pF; Supplier Part: C130253; Manufacturer: ABRACON; Supplier Footprint: SMD3215-2P; JLCPCB Part Class: Extended Part; Datasheet: https://atta.szlcsc.com/upload/public/pdf/source/20180906/C276424_248D5DF2C4B6F2E5DB9021C295D5D581.pdf; Supplier: LCSC; Crystal Type: 贴片晶振; Normal temperature Frequency Tolerance: ±20ppm; Equivalent Series Resistance (ESR): 70kΩ; Design Item ID: CRYSTAL-32.768KHZSMD-3.2X1.5; Library Name: eAFAQ_omnimo_nRF52840_SchLib; Frequency Tolerance: ±20ppm; Load Capacitance: 12.5pF

## Nets
3.3V: C1.1 C2.1 C9.1 C11.1 C25.1 J4.1(VCC) JP1.2 JP2.1 TP2.P$1(1) U1.28(VDD) U1.30(VDDH) U3.5(OUT) U4.8(VCC) U5.1(IN)
GND: C1.2 C2.2 C3.2 C4.2 C5.2 C6.2 C7.1 C8.1 C9.2 C11.2 C21.1 C22.2 C24.2 C25.2 C26.2 D1.C D3.C D4.C D5.GND J1.2 J2L.15 J2L.32 J2L.41 J2L.42 J2R.1(GND) J3.1 J4.3(GND) J4.5(GND) J4.9(GNDDTCT) J5.1(GND) J5.12(GND) R2.1 R5.1 R15.1 R25.1 R26.1 S1.1 S2.1 S3.3 S3.4 S4.3 S4.4 U1.1(GND) U1.2(GND) U1.15(GND) U1.33(GND) U1.55(GND) U2.2(VSS) U3.2(GND) U4.4(VSS) U5.2(GND) U5.7(GND)
VBAT: C6.1 J1.1 J2R.14 Q3.3(D) R14.2 U2.3(VBAT)
VBUS: C5.1 D2.A D6.A J2R.2(5V) J2R.12 J5.2(VBUS) J5.11(VBUS) Q3.1(G) R2.2 U1.32(VBUS) U2.4(VIN)
VIN: C3.1 D6.C Q3.2(S) S1.3 TP1.P$1(1) U3.1(IN)
A0: J2L.39 U1.20(P0.04/AIN2)
A1: J2L.37 U1.21(P0.05/AIN3)
A2: J2L.35 U1.14(P0.30/AIN6)
A3: J2L.33 U1.13(P0.28/AIN4)
A4: J2L.31 U1.11(P0.02/AIN0)
A5: J2L.29 U1.9(P0.03/AIN1)
AN: J2L.28 U1.12(P0.31/AIN7)
D2: J2L.17 J2L.18 U1.26(P1.09)
D5: J2R.5 U1.25(P1.08)
D6: J2R.6 U1.23(P0.07)
D9: J2R.7 U1.19(P0.26)
D10: J2R.8 U1.16(P0.27)
D11: J2R.9 U1.7(P1.14)
D12: J2R.10 U1.6(P1.13)
D13: J2R.11 U1.5(P1.12)
EN: J2R.13 R4.2 U3.3(EN)
LED1: R3.1 U1.3(P1.10)
LED2: R13.1 U1.8(P1.15)
MISO: J2L.23 J2L.24 U1.39(P0.15)
MOSI: J2L.25 J2L.26 U1.37(P0.13)
NEOPIX: D5.DI TP4.P$1(1) U1.38(P0.16)
NFC1: C21.2 J6.2 U1.52(P0.09/NFC1)
NFC2: C22.1 J6.1 U1.54(P0.10/NFC2)
PM5: J2L.40 U1.4(P1.11)
PM6: J2L.38 U1.61(P1.01)
PM7: J2L.36 U1.60(P1.03)
PM8: J2L.34 U1.59(P1.05)
QSPI_CS: U1.44(P0.20) U4.1(CS#)
QSPI_DATA0: U1.41(P0.17) U4.5(SI(IO0))
QSPI_DATA1: U1.46(P0.22) U4.2(SO(IO1))
QSPI_DATA2: U1.45(P0.23) U4.3(WP#(IO2))
QSPI_DATA3: U1.43(P0.21) U4.7(HOLD#(IO3))
QSPI_SCK: U1.42(P0.19) U4.6(SCLK)
QWIIC_SCL: J3.4 U1.22(P0.06)
QWIIC_SDA: J3.3 U1.24(P0.08)
RESET: J2L.46 J4.10(~RESET~) S2.2 S2.3 U1.40(P0.18/RESET)
RXD: J2L.21 J2L.22 U1.48(P0.24)
SCK: J2L.27 U1.36(P0.14)
SCL: J2R.4 U1.27(P0.11)
SDA: J2R.3 U1.29(P0.12)
SWCLK: J4.4(SWDCLK/TCK) U1.53(SWDCLK)
SWDIO: J4.2(SWDIO/TMS) U1.51(SWDIO)
SWITCH1: S3.1 S3.2 U1.50(P1.02)
SWITCH2: S4.1 S4.2 U1.58(P1.07)
SWO: J4.6(SWO/TDO) U1.47(P1.00)
TXD: J2L.19 J2L.20 U1.49(P0.25)
USBD+: J5.6(DP1) J5.8(DP2) R22.1 TP5.P$1(1)
USBD-: J5.5(DN2) J5.7(DN1) R21.1 TP6.P$1(1)
VDIV: R14.1 R15.2 U1.10(P0.29/AIN5)
VOUT: C4.1 C24.1 C26.1 D5.VCC J2L.16 J2L.30 J2L.43 J2L.44 J2L.45 J3.2 U5.5(OUT)
VOUT_EN: R24.1 TP3.P$1(1) U1.56(P1.04) U5.3(EN)
$2N10: R5.2 U2.5(PROG)
$2N11: D2.C R6.2
$2N12: R6.1 U2.1(STAT)
$2N30: D1.A R11.2
$2N46: D3.A R13.2
$2N57: D4.A R3.2
$2N79: JP2.2 R24.2
$2N5060: R4.1 S1.2
$2N5296: J5.10(CC2) R25.2
$2N5302: J5.4(CC1) R26.2
$2N19387: JP1.1 R11.1
$3N1: C7.2 U1.17(P0.00/XL1) Y2.P$1(1)
$3N2: C8.2 U1.18(P0.01/XL2) Y2.P$2(2)
$3N8: R22.2 U1.35(D+)
$3N9: R21.2 U1.34(D-)

Not connected (* = marked no-connect by the designer): D5 DO*; J1 3* 4*; J4 7(KEY)* 8(NC/TDI)*; J5 3(SBU2)* 9(SBU1)* 13(SHELL)* 14(SHELL)*; S1 4* 5* 6* 7*; S2 4* 5*; U1 31(DCCH)* 57(P1.06)*; U3 4(NC)*; U4 9(EP)*; U5 4(FLG)* 6(NC)*

## Notes on the sheets
sheet 1
- USB Connector
- Battery Charger
- Power
- SWD Program/Debug Interface
- 16MBIT QSPI Flash
- I2C - Qwiic/Stemma QT Connector
- VOUT Switching
- LEDs
- NFC Antenna Connector
- Buttons
- RGB LED
sheet 2
- nRF52840 Module
- Omnimo Connection Pads
